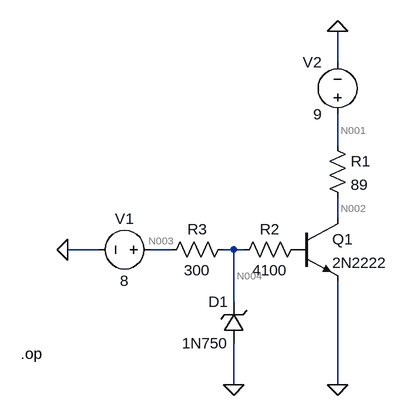
[diagram p0: schematic klucz_3.asc]
klucz_3.asc, the LTspice schematic file:
Version 4
SHEET 1 880 680
WIRE 80 -128 80 -176
WIRE 80 0 80 -48
WIRE 80 112 80 80
WIRE -288 160 -336 160
WIRE -176 160 -208 160
WIRE -80 160 -96 160
WIRE -64 160 -80 160
WIRE -80 240 -80 160
WIRE -80 368 -80 304
WIRE 80 368 80 208
FLAG -336 160 0
FLAG 80 -176 0
FLAG 80 368 0
FLAG -80 368 0
SYMBOL voltage -192 160 R90
WINDOW 0 -32 56 VBottom 2
WINDOW 3 32 56 VTop 2
WINDOW 123 0 0 Left 0
WINDOW 39 0 0 Left 0
SYMATTR InstName V1
SYMATTR Value 8
SYMBOL npn 16 112 R0
SYMATTR InstName Q1
SYMATTR Value 2N2222
SYMBOL res 64 -16 R0
SYMATTR InstName R1
SYMATTR Value 89
SYMBOL voltage 80 -32 R180
WINDOW 0 24 96 Left 2
WINDOW 3 24 16 Left 2
WINDOW 123 0 0 Left 0
WINDOW 39 0 0 Left 0
SYMATTR InstName V2
SYMATTR Value 9
SYMBOL res 32 144 R90
WINDOW 0 0 56 VBottom 2
WINDOW 3 32 56 VTop 2
SYMATTR InstName R2
SYMATTR Value 4100
SYMBOL res -80 144 R90
WINDOW 0 0 56 VBottom 2
WINDOW 3 32 56 VTop 2
SYMATTR InstName R3
SYMATTR Value 300
SYMBOL zener -64 304 R180
WINDOW 0 24 64 Left 2
WINDOW 3 24 0 Left 2
SYMATTR InstName D1
SYMATTR Value 1N750
TEXT -408 320 Left 2 !.op

The netlist it stands for:
* klucz_3.asc
V1 N003 0 8
Q1 N002 P001 0 0 2N2222
R1 N001 N002 89
V2 N001 0 9
R2 P001 N004 4100
R3 N004 N003 300
D1 0 N004 1N750
.model D D
.lib standard.dio
.model NPN NPN
.model PNP PNP
.lib standard.bjt
.op
.backanno
.end

* Results of the author's LTspice run, read from the files saved beside the schematic
* Operating Point:
*   V(n003) = 8 V
*   V(n002) = 182.1 mV
*   V(p001) = 811.3 mV
*   V(n001) = 9 V
*   V(n004) = 4.664 V
*   Ic(Q1) = 99.08 mA
*   Ib(Q1) = 939.7 µA
*   Ie(Q1) = -100 mA
*   I(D1) = -10.18 mA
*   I(R3) = -11.12 mA
*   I(R2) = -939.7 µA
*   I(R1) = 99.08 mA
*   I(V2) = -99.08 mA
*   I(V1) = -11.12 mA
* From the log:
*   Semiconductor Device Operating Points:
*                           --- Diodes ---
*   Name:      d1
*   Model:    1n750
*   Id:     -1.02e-02
*   Vd:     -4.66e+00
*   Req:     5.11e+00
*   CAP:     5.90e-11
*                           --- Bipolar Transistors ---
*   Name:       q1
*   Model:    2n2222
*   Ib:       9.40e-04
*   Ic:       9.91e-02
*   Vbe:      8.11e-01
*   Vbc:      6.29e-01
*   Vce:      1.82e-01
*   BetaDC:   1.05e+02
*   Gm:       3.07e+00
*   Rpi:      3.85e+01
*   Rx:       1.00e+01
*   Ro:       4.14e+01
*   Cbe:      1.49e-09
*   Cbc:      3.12e-09
*   Cjs:      0.00e+00
*   BetaAC:   1.18e+02
*   Cbx:      0.00e+00
*   Ft:       1.06e+08